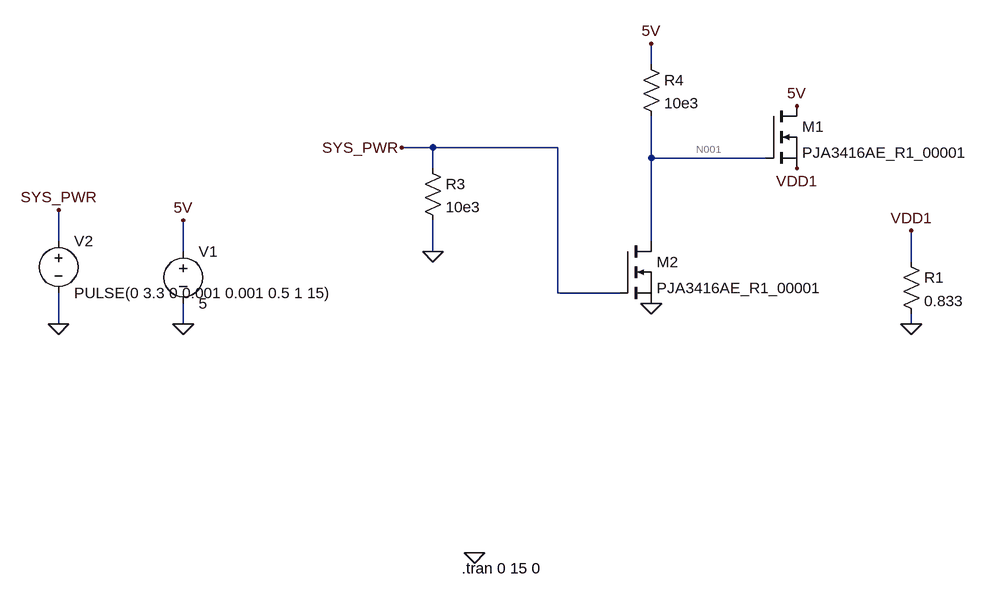
[diagram p0: schematic circuit.asc]
circuit.asc, the LTspice schematic file:
Version 4
SHEET 1 1676 680
WIRE 256 -496 256 -528
WIRE -80 -368 -128 -368
WIRE 112 -368 -80 -368
WIRE 256 -352 256 -416
WIRE 432 -352 256 -352
WIRE -80 -336 -80 -368
WIRE -656 -224 -656 -272
WIRE 256 -224 256 -352
WIRE -464 -208 -464 -256
WIRE -80 -208 -80 -256
WIRE 656 -192 656 -240
WIRE 112 -144 112 -368
WIRE 208 -144 112 -144
WIRE -656 -96 -656 -144
WIRE -464 -96 -464 -128
WIRE 656 -96 656 -112
FLAG -16 256 0
FLAG -464 -96 0
FLAG -464 -256 5V
FLAG -80 -208 0
FLAG -128 -368 SYS_PWR
FLAG -656 -96 0
FLAG -656 -272 SYS_PWR
FLAG 656 -96 0
FLAG 256 -128 0
FLAG 256 -528 5V
FLAG 480 -432 5V
FLAG 480 -336 VDD1
FLAG 656 -240 VDD1
SYMBOL voltage -464 -224 R0
WINDOW 123 0 0 Left 0
WINDOW 39 0 0 Left 0
SYMATTR InstName V1
SYMATTR Value 5
SYMBOL res 640 -208 R0
SYMATTR InstName R1
SYMATTR Value 0.833
SYMBOL nmos 432 -432 R0
SYMATTR InstName M1
SYMATTR Value PJA3416AE_R1_00001
SYMBOL nmos 208 -224 R0
SYMATTR InstName M2
SYMATTR Value PJA3416AE_R1_00001
SYMBOL res -96 -352 R0
SYMATTR InstName R3
SYMATTR Value 10e3
SYMBOL voltage -656 -240 R0
WINDOW 123 0 0 Left 0
WINDOW 39 0 0 Left 0
SYMATTR InstName V2
SYMATTR Value PULSE(0 3.3 0 0.001 0.001 0.5 1 15)
SYMBOL res 240 -512 R0
SYMATTR InstName R4
SYMATTR Value 10e3
TEXT -36 280 Left 2 !.tran 0 15 0

The netlist it stands for:
* circuit.asc
V1 5V 0 5
R1 VDD1 0 0.833
M1 5V N001 VDD1 VDD1 PJA3416AE_R1_00001
M2 N001 SYS_PWR 0 0 PJA3416AE_R1_00001
R3 SYS_PWR 0 10e3
V2 SYS_PWR 0 PULSE(0 3.3 0 0.001 0.001 0.5 1 15)
R4 5V N001 10e3
.model NMOS NMOS
.model PMOS PMOS
.lib standard.mos
.tran 0 15 0
.backanno
.end

* Results of the author's LTspice run, read from the files saved beside the schematic
* Operating Point, zero values left out:
*   V(5v) = 5 V
*   V(vdd1) = 208.2 µV
*   V(n001) = 5 V
*   Id(M2) = 10.01 pA
*   Ib(M2) = -5.01 pA
*   Is(M2) = -5 pA
*   Id(M1) = 250 µA
*   Ib(M1) = -5.01 pA
*   Is(M1) = -250 µA
*   I(R4) = 10.01 pA
*   I(R1) = 250 µA
*   I(V1) = -250 µA
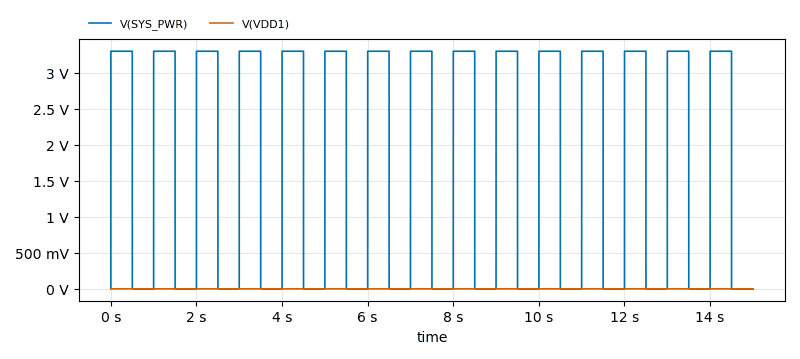
[diagram p1: Transient Analysis of circuit.asc, plotted from the saved traces]
* Transient Analysis, 1 run:
*   V(SYS_PWR): min 0 V, max 3.3 V, average 1.653 V, rms 2.335 V, last 0 V
*   V(VDD1): min 127.4 µV, max 208.2 µV, average 167.8 µV, rms 172.6 µV, last 208.2 µV